# Altium schematic sheet Sheet2.SchDoc
size C
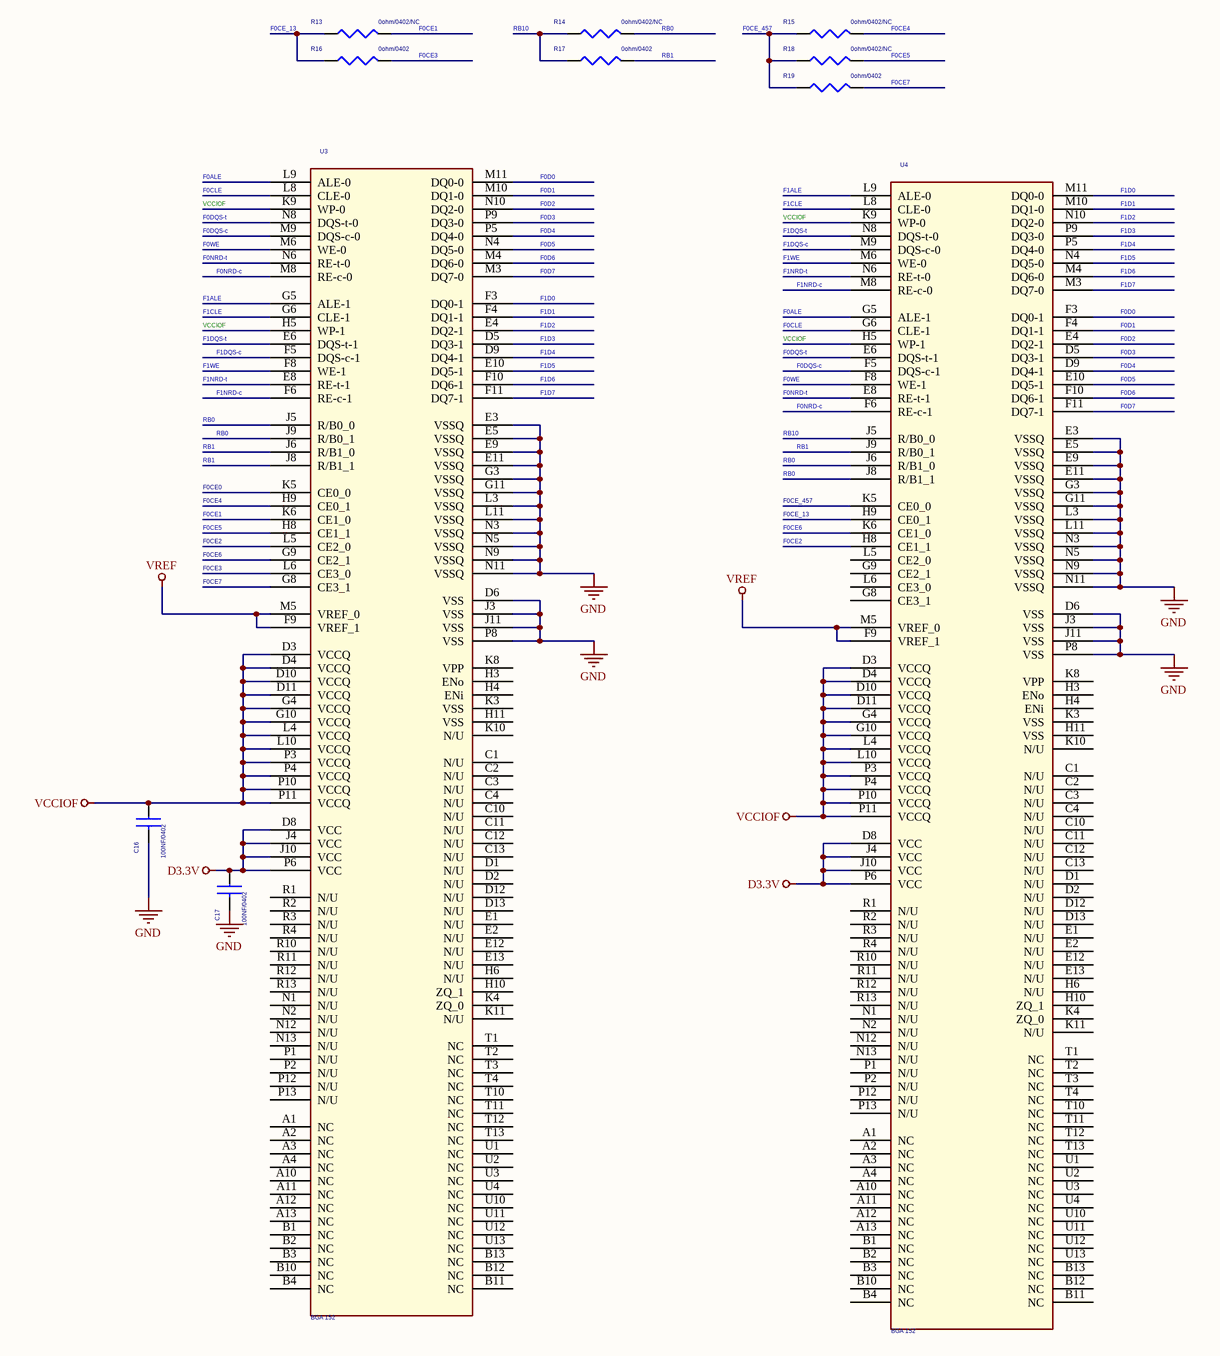
[diagram p0: Sheet2.SchDoc]

## Parts
C16  100NF/0402  [C0402]
C17  100NF/0402  [C0402]
R13  0ohm/0402/NC  [R0201]
R14  0ohm/0402/NC  [R0201]
R15  0ohm/0402/NC  [R0201]
R16  0ohm/0402  [R0201]
R17  0ohm/0402  [R0201]
R18  0ohm/0402/NC  [R0201]
R19  0ohm/0402  [R0201]
U3  BGA 152  [bga152_1_0_14x18]
U4  BGA 152  [bga152_1_0_14x18]

## Nets
D3.3V: C17.1 U3.D8(VCC) U3.J4(VCC) U3.J10(VCC) U3.P6(VCC) U4.D8(VCC) U4.J4(VCC) U4.J10(VCC) U4.P6(VCC)
GND: C16.2 C17.2 U3.D6(VSS) U3.E3(VSSQ) U3.E5(VSSQ) U3.E9(VSSQ) U3.E11(VSSQ) U3.G3(VSSQ) U3.G11(VSSQ) U3.J3(VSS) U3.J11(VSS) U3.L3(VSSQ) U3.L11(VSSQ) U3.N3(VSSQ) U3.N5(VSSQ) U3.N9(VSSQ) U3.N11(VSSQ) U3.P8(VSS) U4.D6(VSS) U4.E3(VSSQ) U4.E5(VSSQ) U4.E9(VSSQ) U4.E11(VSSQ) U4.G3(VSSQ) U4.G11(VSSQ) U4.J3(VSS) U4.J11(VSS) U4.L3(VSSQ) U4.L11(VSSQ) U4.N3(VSSQ) U4.N5(VSSQ) U4.N9(VSSQ) U4.N11(VSSQ) U4.P8(VSS)
VCCIOF: C16.1 U3.D3(VCCQ) U3.D4(VCCQ) U3.D10(VCCQ) U3.D11(VCCQ) U3.G4(VCCQ) U3.G10(VCCQ) U3.H5(WP-1) U3.K9(WP-0) U3.L4(VCCQ) U3.L10(VCCQ) U3.P3(VCCQ) U3.P4(VCCQ) U3.P10(VCCQ) U3.P11(VCCQ) U4.D3(VCCQ) U4.D4(VCCQ) U4.D10(VCCQ) U4.D11(VCCQ) U4.G4(VCCQ) U4.G10(VCCQ) U4.H5(WP-1) U4.K9(WP-0) U4.L4(VCCQ) U4.L10(VCCQ) U4.P3(VCCQ) U4.P4(VCCQ) U4.P10(VCCQ) U4.P11(VCCQ)
VREF: U3.F9(VREF_1) U3.M5(VREF_0) U4.F9(VREF_1) U4.M5(VREF_0)
F0ALE: U3.L9(ALE-0) U4.G5(ALE-1)
F0CE0: U3.K5(CE0_0)
F0CE1: R13.2 U3.K6(CE1_0)
F0CE2: U3.L5(CE2_0) U4.H8(CE1_1)
F0CE3: R16.2 U3.L6(CE3_0)
F0CE4: R15.2 U3.H9(CE0_1)
F0CE5: R18.2 U3.H8(CE1_1)
F0CE6: U3.G9(CE2_1) U4.K6(CE1_0)
F0CE7: R19.2 U3.G8(CE3_1)
F0CE_13: R13.1 R16.1 U4.H9(CE0_1)
F0CE_457: R15.1 R18.1 R19.1 U4.K5(CE0_0)
F0CLE: U3.L8(CLE-0) U4.G6(CLE-1)
F0D0: U3.M11(DQ0-0) U4.F3(DQ0-1)
F0D1: U3.M10(DQ1-0) U4.F4(DQ1-1)
F0D2: U3.N10(DQ2-0) U4.E4(DQ2-1)
F0D3: U3.P9(DQ3-0) U4.D5(DQ3-1)
F0D4: U3.P5(DQ4-0) U4.D9(DQ4-1)
F0D5: U3.N4(DQ5-0) U4.E10(DQ5-1)
F0D6: U3.M4(DQ6-0) U4.F10(DQ6-1)
F0D7: U3.M3(DQ7-0) U4.F11(DQ7-1)
F0DQS-c: U3.M9(DQS-c-0) U4.F5(DQS-c-1)
F0DQS-t: U3.N8(DQS-t-0) U4.E6(DQS-t-1)
F0NRD-c: U3.M8(RE-c-0) U4.F6(RE-c-1)
F0NRD-t: U3.N6(RE-t-0) U4.E8(RE-t-1)
F0WE: U3.M6(WE-0) U4.F8(WE-1)
F1ALE: U3.G5(ALE-1) U4.L9(ALE-0)
F1CLE: U3.G6(CLE-1) U4.L8(CLE-0)
F1D0: U3.F3(DQ0-1) U4.M11(DQ0-0)
F1D1: U3.F4(DQ1-1) U4.M10(DQ1-0)
F1D2: U3.E4(DQ2-1) U4.N10(DQ2-0)
F1D3: U3.D5(DQ3-1) U4.P9(DQ3-0)
F1D4: U3.D9(DQ4-1) U4.P5(DQ4-0)
F1D5: U3.E10(DQ5-1) U4.N4(DQ5-0)
F1D6: U3.F10(DQ6-1) U4.M4(DQ6-0)
F1D7: U3.F11(DQ7-1) U4.M3(DQ7-0)
F1DQS-c: U3.F5(DQS-c-1) U4.M9(DQS-c-0)
F1DQS-t: U3.E6(DQS-t-1) U4.N8(DQS-t-0)
F1NRD-c: U3.F6(RE-c-1) U4.M8(RE-c-0)
F1NRD-t: U3.E8(RE-t-1) U4.N6(RE-t-0)
F1WE: U3.F8(WE-1) U4.M6(WE-0)
RB0: R14.2 U3.J5(R/B0_0) U3.J9(R/B0_1) U4.J6(R/B1_0) U4.J8(R/B1_1)
RB1: R17.2 U3.J6(R/B1_0) U3.J8(R/B1_1) U4.J9(R/B0_1)
RB10: R14.1 R17.1 U4.J5(R/B0_0)

Not connected (* = marked no-connect by the designer): U3 A1(NC) A2(NC) A3(NC) A4(NC) A10(NC) A11(NC) A12(NC) A13(NC) B1(NC) B2(NC) B3(NC) B4(NC) B10(NC) B11(NC) B12(NC) B13(NC) C1(N/U) C2(N/U) C3(N/U) C4(N/U) C10(N/U) C11(N/U) C12(N/U) C13(N/U) D1(N/U) D2(N/U) D12(N/U) D13(N/U) E1(N/U) E2(N/U) E12(N/U) E13(N/U) H3(ENo) H4(ENi) H6(N/U) H10(ZQ_1) H11(VSS) K3(VSS) K4(ZQ_0) K8(VPP) K10(N/U) K11(N/U) N1(N/U) N2(N/U) N12(N/U) N13(N/U) P1(N/U) P2(N/U) P12(N/U) P13(N/U) R1(N/U) R2(N/U) R3(N/U) R4(N/U) R10(N/U) R11(N/U) R12(N/U) R13(N/U) T1(NC) T2(NC) T3(NC) T4(NC) T10(NC) T11(NC) T12(NC) T13(NC) U1(NC) U2(NC) U3(NC) U4(NC) U10(NC) U11(NC) U12(NC) U13(NC); U4 A1(NC) A2(NC) A3(NC) A4(NC) A10(NC) A11(NC) A12(NC) A13(NC) B1(NC) B2(NC) B3(NC) B4(NC) B10(NC) B11(NC) B12(NC) B13(NC) C1(N/U) C2(N/U) C3(N/U) C4(N/U) C10(N/U) C11(N/U) C12(N/U) C13(N/U) D1(N/U) D2(N/U) D12(N/U) D13(N/U) E1(N/U) E2(N/U) E12(N/U) E13(N/U) G8(CE3_1) G9(CE2_1) H3(ENo) H4(ENi) H6(N/U) H10(ZQ_1) H11(VSS) K3(VSS) K4(ZQ_0) K8(VPP) K10(N/U) K11(N/U) L5(CE2_0) L6(CE3_0) N1(N/U) N2(N/U) N12(N/U) N13(N/U) P1(N/U) P2(N/U) P12(N/U) P13(N/U) R1(N/U) R2(N/U) R3(N/U) R4(N/U) R10(N/U) R11(N/U) R12(N/U) R13(N/U) T1(NC) T2(NC) T3(NC) T4(NC) T10(NC) T11(NC) T12(NC) T13(NC) U1(NC) U2(NC) U3(NC) U4(NC) U10(NC) U11(NC) U12(NC) U13(NC)

## Library data of the parts
C16 C17 = C0402_Dup1: PART_TYPE: 11_C; PART_NUMBER: 11G101104340; MANUFACTURER_PN: 0402F104Z250CT; MANUFACTURER: WALSIN; TOLERANCE: +80/-20%; QVL_APPROVE: N; OPTIONAL: I; ELECTRIC_SPEC: 25V 0402 Y5V +80/-20%; COMPONENT_NAME: MLCC SMD 100NF 25V 0402 Y5V +80/-20%; CLASS: Passive; TABLES: 11; PACKAGE_TYPE: SMD; DATASHEET: T:\division\SD\JM_CIS_Database\05_Datasheet\11_Capacitor\Walsin_MLCC_All.pdf; DATABASE_UPDATE: 2009/10/6; CRITICAL_PART: N; CREATED_DATE: 2009/10/6
R13-R19 = R
U3 U4 = TMP_0